# Altium project ATU.PrjPcb
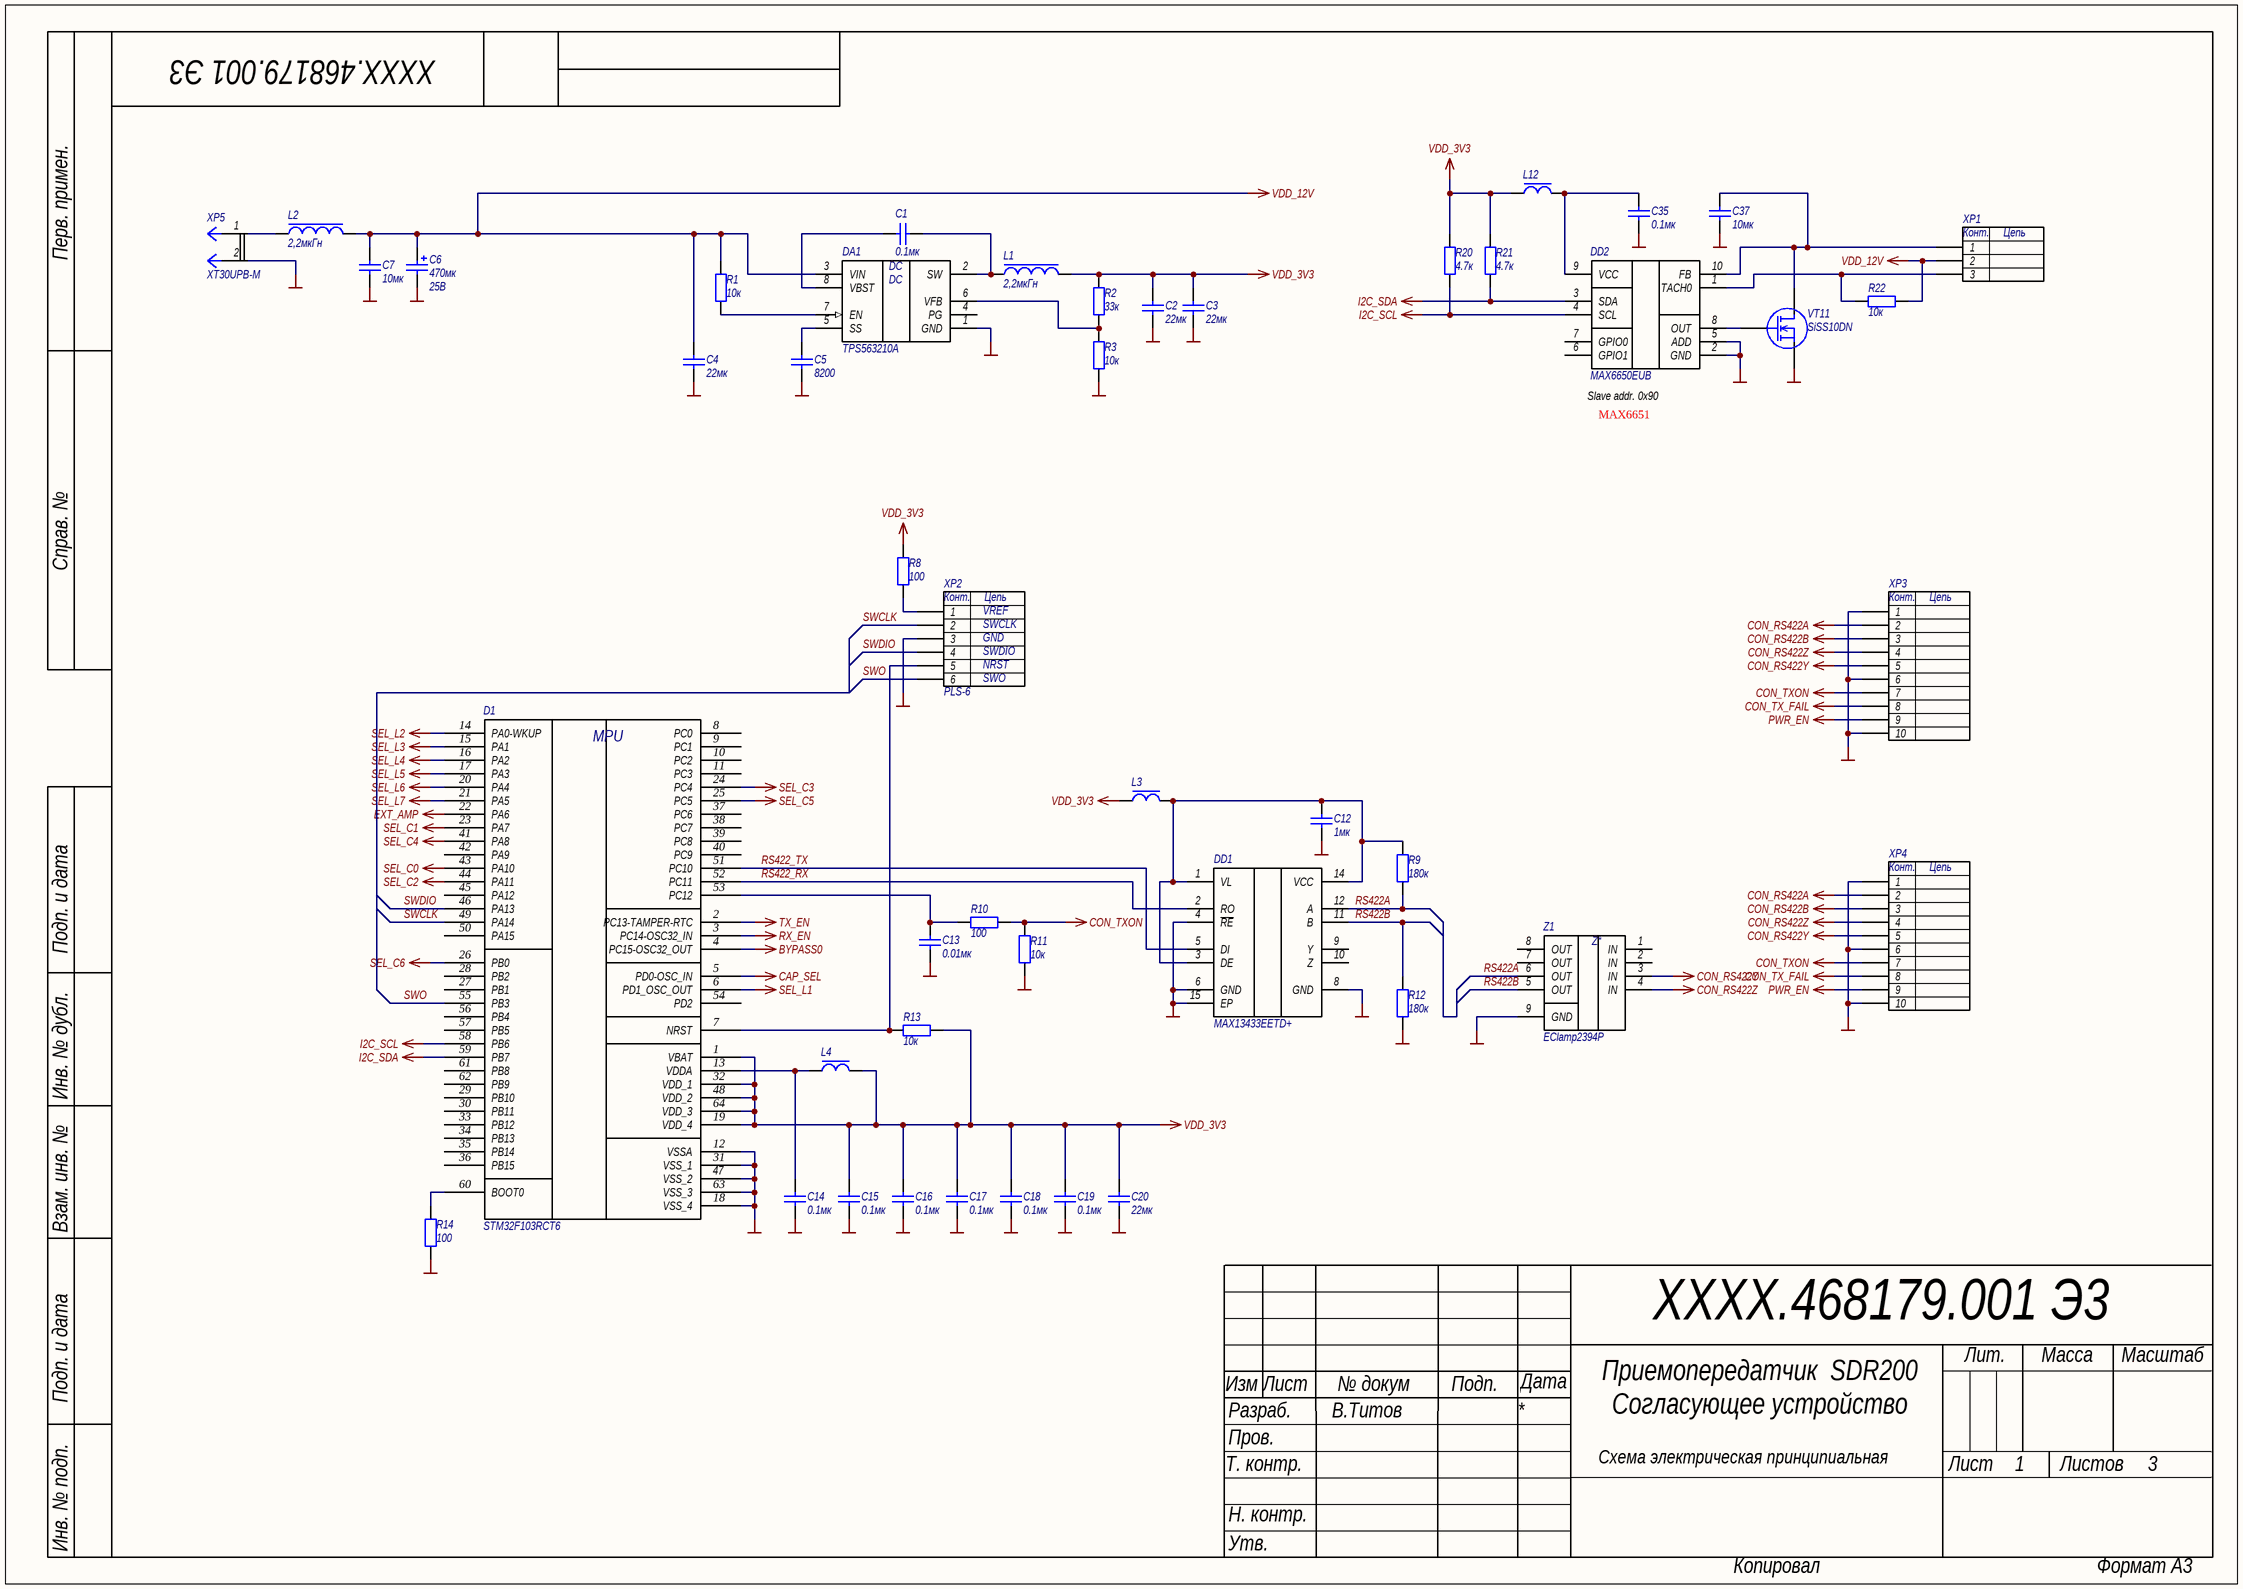
[diagram p0: ATU_MCU.SchDoc]
3 sheets, 161 parts. Net scope: global (net labels, ports and power ports of the same name join across sheets).
Board file: ATU.PcbDoc
Sheets:
  ATU_MCU.SchDoc
  ATU_RF.SchDoc
  ATU_LC.SchDoc

## Sheet ATU_MCU.SchDoc: Приемопередатчик  SDR200
size 420 x 297 mm; Author: В.Титов; DrawnBy: В.Титов; DocumentNumber: ХХХХ.468179.001 Э3; SheetNumber: 1; SheetTotal: 3; DocumentType: Схема электрическая принципиальная; Title2: Согласующее устройство; Scale: 1:1

### Parts
C1  0.1мк  [CAPC1005X06N]
C2  22мк  [CAPC2012X12L]
C3  22мк  [CAPC2012X12L]
C4  22мк  [CAPC2012X12L]
C5  8200  [CAPC1005X06N]
C6  Power/Voltage: 25В  [CAPAE116103X105N]  (hidden comment: 470мк)
C7  10мк  [CAPC3225X27L]
C12  1мк  [CAPC1005X06N]
C13  0.01мк  [CAPC1005X06N]
C14  0.1мк  [CAPC1005X06N]
C15  0.1мк  [CAPC1005X06N]
C16  0.1мк  [CAPC1005X06N]
C17  0.1мк  [CAPC1005X06N]
C18  0.1мк  [CAPC1005X06N]
C19  0.1мк  [CAPC1005X06N]
C20  22мк  [CAPC2012X12L]
C35  0.1мк  [CAPC1005X06N]
C37  10мк  [CAPC3225X27L]
D1  STM32F103RCT6  [QFP50P1200X1200X160-64N]
DA1  TPS563210A  [TSOP65P280X110-8N]
DD1  MAX13433EETD+  [SON40P300X80_HS-15L]
DD2  MAX6650EUB  [SOP64P600X175-16N]
L1  2,2мкГн  [CSAB0420]
L2  2,2мкГн  [CSAB0420]
L3  BLM18PG121SN1D  [INDC1608X08L]  (value not drawn)
L4  BLM18PG121SN1D  [INDC1608X08L]  (value not drawn)
L12  BLM18PG121SN1D  [INDC1608X08L]  (value not drawn)
R1  10к  [RESC1005X06N]
R2  33к  [RESC1005X06N]
R3  10к  [RESC1005X06N]
R8  100  [RESC1005X06N]
R9  180к  [RESC1005X06N]
R10  100  [RESC1005X06N]
R11  10к  [RESC1005X06N]
R12  180к  [RESC1005X06N]
R13  10к  [RESC1005X06N]
R14  100  [RESC1005X06N]
R20  4.7к  [RESC1005X06N]
R21  4.7к  [RESC1005X06N]
R22  10к  [RESC1005X06N]
VT11  SiSS10DN  [PowerPAK_1212-8W]
XP1  22232031  [22232031]  (value not drawn)
XP2  PLS-6  [HDR1X6]
XP3  FH12-10S-0.5SVA  [FH12-10S-0.5SH]  (value not drawn)
XP4  FH12-10S-0.5SVA  [FH12-10S-0.5SH]  (value not drawn)
XP5  XT30UPB-M  [XT30UPB-M]
Z1  EClamp2394P  [SON50P160X65_HS-9N]

### Nets
BYPASS0: D1.4(PC15-OSC32_OUT)
CAP_SEL: D1.5(PD0-OSC_IN)
CON_RS422A: XP3.2 XP4.2
CON_RS422B: XP3.3 XP4.3
CON_RS422Y: XP3.5 XP4.5 Z1.3(IN)
CON_RS422Z: XP3.4 XP4.4 Z1.4(IN)
CON_TX_FAIL: XP3.8 XP4.8
CON_TXON: R10.1 R11.1 XP3.7 XP4.7
EXT_AMP: D1.22(PA6)
GND: C2.1 C3.1 C4.1 C5.1 C6.2 C7.1 C12.1 C13.1 C14.1 C15.1 C16.1 C17.1 C18.1 C19.1 C20.1 C35.1 C37.1 D1.12(VSSA) D1.18(VSS_4) D1.31(VSS_1) D1.47(VSS_2) D1.63(VSS_3) DA1.1(GND) DD1.4(~{RE}) DD1.6(GND) DD1.8(GND) DD1.15(EP) DD2.2(GND) DD2.5(ADD) R3.2 R11.2 R12.1 R14.2 VT11.S XP2.3 XP3.1 XP3.6 XP3.10 XP4.1 XP4.6 XP4.10 XP5.2 Z1.9(GND)
I2C_SCL: D1.58(PB6) DD2.4(SCL) R20.1
I2C_SDA: D1.59(PB7) DD2.3(SDA) R21.1
PWR_EN: XP3.9 XP4.9
RX_EN: D1.3(PC14-OSC32_IN)
SEL_C0: D1.43(PA10)
SEL_C1: D1.23(PA7)
SEL_C2: D1.44(PA11)
SEL_C3: D1.24(PC4)
SEL_C4: D1.41(PA8)
SEL_C5: D1.25(PC5)
SEL_C6: D1.26(PB0)
SEL_L1: D1.6(PD1_OSC_OUT)
SEL_L2: D1.14(PA0-WKUP)
SEL_L3: D1.15(PA1)
SEL_L4: D1.16(PA2)
SEL_L5: D1.17(PA3)
SEL_L6: D1.20(PA4)
SEL_L7: D1.21(PA5)
TX_EN: D1.2(PC13-TAMPER-RTC)
VDD_3V3: C2.2 C3.2 C15.2 C16.2 C17.2 C18.2 C19.2 C20.2 D1.1(VBAT) D1.19(VDD_4) D1.32(VDD_1) D1.48(VDD_2) D1.64(VDD_3) L1.2 L3.1 L4.2 L12.1 R2.2 R8.1 R13.2 R20.2 R21.2
VDD_12V: C4.2 C6.1 C7.2 DA1.3(VIN) L2.2 R1.2 R22.2 XP1.2
RS422_RX: D1.52(PC11) DD1.2(RO)
RS422_TX: D1.51(PC10) DD1.5(DI)
RS422A: DD1.12(A) R9.1 Z1.6(OUT)
RS422B: DD1.11(B) R12.2 Z1.5(OUT)
SWCLK: D1.49(PA14) XP2.2
SWDIO: D1.46(PA13) XP2.4
SWO: D1.55(PB3) XP2.6
NetC1_1: C1.1 DA1.2(SW) L1.1
NetC1_2: C1.2 DA1.8(VBST)
NetC5_2: C5.2 DA1.5(SS)
NetC12_2: C12.2 DD1.1(VL) DD1.3(DE) DD1.14(VCC) L3.2 R9.2
NetC13_2: C13.2 D1.53(PC12) R10.2
NetC14_2: C14.2 D1.13(VDDA) L4.1
NetC35_2: C35.2 DD2.9(VCC) L12.2
NetC37_2: C37.2 DD2.10(FB) VT11.D XP1.1
NetD1_7: D1.7(NRST) R13.1 XP2.5
NetD1_60: D1.60(BOOT0) R14.1
NetDA1_6: DA1.6(VFB) R2.1 R3.1
NetDA1_7: DA1.7(EN) R1.1
NetDD2_1: DD2.1(TACH0) R22.1 XP1.3
NetDD2_8: DD2.8(OUT) VT11.G
NetL2_1: L2.1 XP5.1
NetR8_2: R8.2 XP2.1

Not connected (* = marked no-connect by the designer): D1 8(PC0) 9(PC1) 10(PC2) 11(PC3) 27(PB1) 28(PB2) 29(PB10) 30(PB11) 33(PB12) 34(PB13) 35(PB14) 36(PB15) 37(PC6) 38(PC7) 39(PC8) 40(PC9) 42(PA9) 45(PA12) 50(PA15) 54(PD2) 56(PB4) 57(PB5) 61(PB8) 62(PB9); DA1 4(PG); DD1 9(Y) 10(Z); DD2 6(GPIO1) 7(GPIO0); Z1 1(IN) 2(IN) 7(OUT) 8(OUT)

### Notes on the sheet
- (near DD2) Slave addr. 0x90
- MAX6651
- (near XP2) VREF
- (near XP2) SWCLK
- (near XP2) GND
- (near XP2) SWDIO
- (near XP2) NRST
- (near XP2) SWO
- Перв. примен.
- Справ. №
- Подп. и дата
- Инв. № дубл.
- Взам. инв. №
- Изм
- Лист
- № докум
- Подп.
- Дата
- Лит.
- Масса
- Масштаб
- Т. контр.
- Разраб.
- Пров.
- Листов
- Н. контр.
- Инв. № подп.
- Утв.
- Копировал
- Формат А3
- (in symbol Микросхема STM32F103RCT6) MPU
- (in symbol Микросхема TPS563210A) DC
- (in symbol Соединитель 22232031) Конт.; Цепь
- (in symbol Соединитель FH12-10S-0.5SVA) Конт.; Цепь
- (in symbol Соединитель PLS-6) Конт.; Цепь
- (in symbol Фильтр EMI EClamp2394P) Z*

### Library data of the parts
C1 C14-C19 C35 = Кер.ЧИП конд. 0402 0.1мкФ X7R 10%, 16В: Кер. ЧИП-конденсатор; Power/Voltage: 16В; TKE: X7R; Tolerance: ±10%; PackageReference: 0402; Value: 0.1мк
C2-C4 C20 = Кер.ЧИП конд. 0805 22мкФ X5R 10% 16В: Кер. ЧИП-конденсатор; Manufacturer: TDK; ManufacturerPartNumber: C2012X5R1C226KT; Power/Voltage: 16В; TKE: X5R; Tolerance: ±10%; Value: 22мк
C5 = Кер.ЧИП конд. 0402 8200пФ X7R 10%, 50В: Кер. ЧИП-конденсатор; Power/Voltage: 50В; TKE: X7R; Tolerance: ±20%; Value: 8200
C6 = Конденсатор гибридный SMD 470мкФ ±20% 25В: Гибридный ЧИП-конденсатор; ManufacturerPartNumber: EEHZK1E471P; Manufacturer: Panasonic; Tolerance: ±20%; Published: 8-Jun-2000; LatestRevisionDate: 29-May-2009; LatestRevisionNote: IPC-7351 Footprint Added.; Publisher: Altium Limited; PackageDescription: ZK series; PackageReference: ZK series; Value: 470мк
C7 C37 = Кер.ЧИП конд. 1210 10мкФ X5R 20% 50В: Кер. ЧИП-конденсатор; Manufacturer: Murata; ManufacturerPartNumber: GRM32ER71H106; Power/Voltage: 50В; TKE: X5R; Tolerance: ±20%; Value: 10мк
C12 = Кер.ЧИП конд. 0402 1мкФ X5R 10%, 10В: Кер. ЧИП-конденсатор; Power/Voltage: 10В; TKE: X5R; Tolerance: ±10%; PackageReference: 0402; Value: 1мк
C13 = Кер.ЧИП конд. 0402 0.01мкФ X7R 10%, 50В: Кер. ЧИП-конденсатор; Power/Voltage: 50В; TKE: X7R; Tolerance: ±20%; Value: 0.01мк
D1 = Микросхема STM32F103RCT6: Ultra-low-power 32-bit MCU ARM®-based Cortex®-M3, 128KB Flash, 16KB SRAM, 4KB EEPROM, LCD, USB, ADC, DAC; Manufacturer: STMicroelectronics; Published: 29-Jan-2009; Code_JEDEC: MS-026; ComponentLink1Description: Manufacturer Link; ComponentLink3Description: Packaging Specification; Value: STM32F103RCT6
DA1 = Микросхема TPS563210A: TPS56x210A, 4.5-V to 17-V Input, 2-A, 3-A Synchrono; Manufacturer: TI; Value: TPS563210A
DD1 = Микросхема MAX13433EETD+: RS-422 Transceivers with Low-Voltage Logic Interface 16M; Manufacturer: Maxim; Value: MAX13433EETD+; ComponentLink1Description: datasheet; ComponentLink1URL: https://datasheets.maximintegrated.com/en/ds/MAX13430E-MAX13433E.pdf
DD2 = Микросхема MAX6650EUB: Fan-Speed Regulators and Monitors with SMBus/I2C-Compatible Interface; Manufacturer: Maxim; Value: MAX6650EUB; ComponentLink1Description: datasheet; ComponentLink1URL: https://www.analog.com/media/en/technical-documentation/data-sheets/MAX6650-MAX6651.pdf
L1 L2 = ЧИП индуктивность CSAB0420-2R2M: Molding Power Choke; Manufacturer: Vishay; ManufacturerPartNumber: IHLP1616ABER1R0M11; Value: 2,2мкГн
L3 L4 L12 = ЧИП дроссель 0603 BLM18PG121SN1D: SMD EMI Suppression Filter EMIFIL; Manufacturer: Murata; ManufacturerPartNumber: BLM18PG121SN1D; Value: BLM18PG121SN1D
R1 = Чип резистор 0402 10 кОм, 1%: ЧИП-резистор; Tolerance: ±5%; TKE: 100 ppm/°С; PackageReference: 0402; Value: 10к
R2 = Чип резистор 0402 33 кОм, 5%: ЧИП-резистор; Tolerance: ±5%; TKE: 100 ppm/°С; PackageReference: 0402; Value: 33к
R3 R11 R13 R22 = Чип резистор 0402 10 кОм, 5%: ЧИП-резистор; Tolerance: ±5%; TKE: 100 ppm/°С; PackageReference: 0402; Value: 10к
R8 R10 R14 = Чип резистор 0402 100 Ом, 5%: ЧИП-резистор; Tolerance: ±5%; TKE: 100 ppm/°С; PackageReference: 0402; Value: 100
R9 R12 = Чип резистор 0402 180 кОм, 5%: ЧИП-резистор; Tolerance: ±5%; TKE: 100 ppm/°С; PackageReference: 0402; Value: 180к
R20 R21 = Чип резистор 0402 4,7 кОм, 5%: ЧИП-резистор; Tolerance: ±5%; TKE: 100 ppm/°С; PackageReference: 0402; Value: 4.7к
VT11 = ЧИП транзистор SiSS10DN: N-Channel 40 V (D-S) MOSFET; ComponentLink1Description: datasheet; ComponentLink1URL: https://www.vishay.com/docs/65439/siss10dn.pdf; Value: SiSS10DN
XP1 = Соединитель 22232031: Molex 2,54 мм pitch-3; Manufacturer: Connfly; Value: 22232031
XP2 = Соединитель PLS-6: Вилка штыревая 2.54мм 1x6 прямая тип1; LatestRevisionDate: 17-Jul-2002; LatestRevisionNote: Re-released for DXP Platform.; Publisher: Altium Limited; Value: PLS-6
XP3 XP4 = Соединитель FH12-10S-0.5SVA: 0.5mm  Pitch FPC/FFC Connector FH12 Series; Manufacturer: Hirose; Value: FH12-10S-0.5SVA
XP5 = Соединитель XT30UPB-M: AMASS XT30UPB-M  5 mm; Value: XT30UPB-M
Z1 = Фильтр EMI EClamp2394P: ESD/EMI Protection  for Color LCD Interfaces; Manufacturer: SEMTECH; PackageReference: SLP2116P8; Value: EClamp2394P

## Sheet ATU_RF.SchDoc: Приемопередатчик  SDR200
size 420 x 297 mm; Author: В.Титов; DrawnBy: В.Титов; DocumentNumber: ХХХХ.468179.001 Э3; SheetNumber: 2; SheetTotal: 3; DocumentType: Схема электрическая принципиальная; Title2: Согласующее устройство; Scale: 1:1
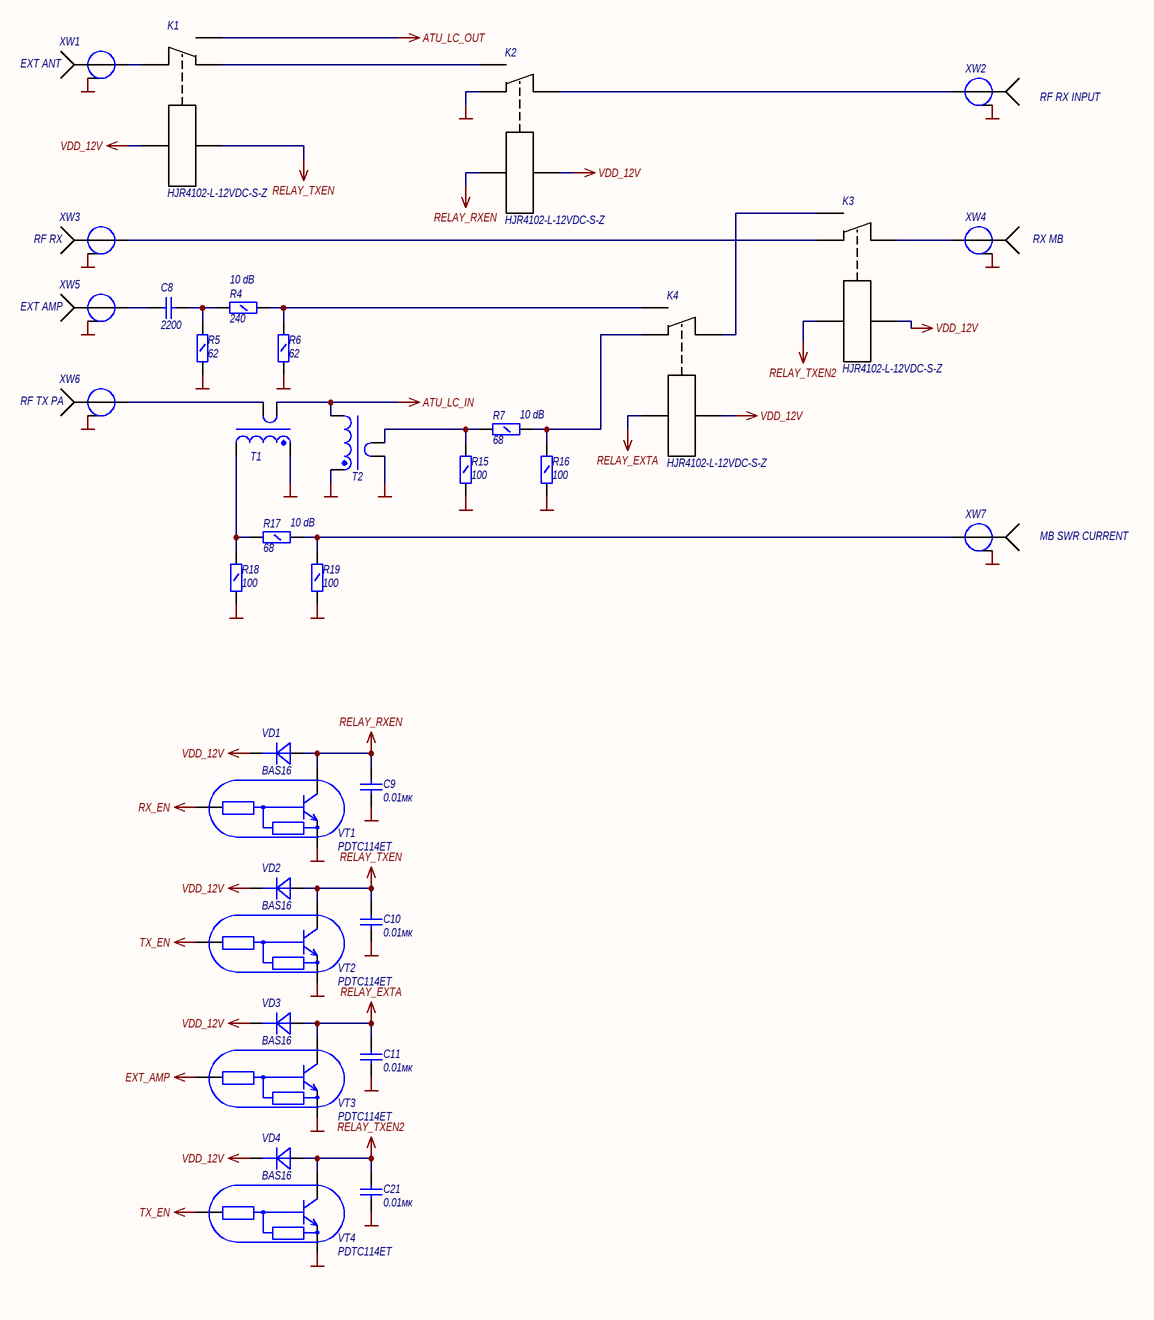
[diagram p1: ATU_RF.SchDoc]

### Parts
C8  2200  [CAPC3216X19L]
C9  0.01мк  [CAPC1005X06N]
C10  0.01мк  [CAPC1005X06N]
C11  0.01мк  [CAPC1005X06N]
C21  0.01мк  [CAPC1005X06N]
K1  HJR4102-L-12VDC-S-Z  [HJR4102]
K2  HJR4102-L-12VDC-S-Z  [HJR4102]
K3  HJR4102-L-12VDC-S-Z  [HJR4102]
K4  HJR4102-L-12VDC-S-Z  [HJR4102]
R4  240  [RESC3216X04L]
R5  62  [RESC3216X04L]
R6  62  [RESC3216X04L]
R7  68  [RESC3216X04L]
R15  100  [RESC3216X04L]
R16  100  [RESC3216X04L]
R17  68  [RESC3216X04L]
R18  100  [RESC3216X04L]
R19  100  [RESC3216X04L]
T1  Трансформатор SWR_CURRENT  [TRSF PA CURRENT]  (value not drawn)
T2  Трансформатор SWR_VOLTAGE  [TRSF PA VOLTAGE]  (value not drawn)
VD1  BAS16  [SOT23_N]
VD2  BAS16  [SOT23_N]
VD3  BAS16  [SOT23_N]
VD4  BAS16  [SOT23_N]
VT1  PDTC114ET  [SOT23_N]
VT2  PDTC114ET  [SOT23_N]
VT3  PDTC114ET  [SOT23_N]
VT4  PDTC114ET  [SOT23_N]
XW1  SMA-JR  [SMA-JR]  (value not drawn)
XW2  SMA-JR  [SMA-JR]  (value not drawn)
XW3  SMA-JR  [SMA-JR]  (value not drawn)
XW4  SMA-JR  [SMA-JR]  (value not drawn)
XW5  SMA-JR  [SMA-JR]  (value not drawn)
XW6  SMA-JR  [SMA-JR]  (value not drawn)
XW7  SMA-JR  [SMA-JR]  (value not drawn)

### Nets
ATU_LC_IN: T1.1 T2.4
ATU_LC_OUT: K1.6
EXT_AMP: VT3.1(B)
GND: C9.1 C10.1 C11.1 C21.1 K2.7 R5.1 R6.1 R15.1 R16.1 R18.1 R19.1 T1.3 T2.1 T2.3 VT1.2(E) VT2.2(E) VT3.2(E) VT4.2(E) XW1.2 XW2.2 XW3.2 XW4.2 XW5.2 XW6.2 XW7.2
RELAY_EXTA: C11.2 K4.5 VD3.1(A) VT3.3(C)
RELAY_RXEN: C9.2 K2.5 VD1.1(A) VT1.3(C)
RELAY_TXEN: C10.2 K1.5 VD2.1(A) VT2.3(C)
RELAY_TXEN2: C21.2 K3.5 VD4.1(A) VT4.3(C)
RX_EN: VT1.1(B)
TX_EN: VT2.1(B) VT4.1(B)
VDD_12V: K1.8 K2.8 K3.8 K4.8 VD1.3(K) VD2.3(K) VD3.3(K) VD4.3(K)
NetC8_1: C8.1 R4.1 R5.2
NetC8_2: C8.2 XW5.1
NetK1_1: K1.1 XW1.1
NetK1_7: K1.7 K2.6
NetK2_1: K2.1 XW2.1
NetK3_1: K3.1 XW4.1
NetK3_6: K3.6 K4.1
NetK3_7: K3.7 XW3.1
NetK4_6: K4.6 R4.2 R6.2
NetK4_7: K4.7 R7.2 R16.2
NetR7_1: R7.1 R15.2 T2.2
NetR17_1: R17.1 R18.2 T1.4
NetR17_2: R17.2 R19.2 XW7.1
NetT1_2: T1.2 XW6.1

### Notes on the sheet
- (near XW1) EXT ANT
- RF RX INPUT
- (near XW3) RF RX
- (near R4) 10 dB
- RX MB
- EXT AMP
- (near XW6) RF TX PA
- (near R7) 10 dB
- (near R17) 10 dB
- MB SWR CURRENT
- Перв. примен.
- Справ. №
- Подп. и дата
- Инв. № дубл.
- Взам. инв. №
- Изм
- Лист
- № докум
- Подп.
- Дата
- Лит.
- Масса
- Масштаб
- Т. контр.
- Разраб.
- Пров.
- Листов
- Н. контр.
- Инв. № подп.
- Утв.
- Копировал
- Формат А3

### Library data of the parts
C8 = Кер.ЧИП конд. 1206 2200пФ X7К 10% 1000В: Кер. ЧИП-конденсатор; Manufacturer: WALSIN; ManufacturerPartNumber: 1206B222K102; Power/Voltage: 1000В; TKE: X7R; Tolerance: ±10%; Value: 2200
C9-C11 C21 = Кер.ЧИП конд. 0402 0.01мкФ X7R 10%, 50В: as C13 on sheet ATU_MCU; Value: 0.01мк
K1-K4 = Реле HJR4102-L-12VDC-S-Z: Реле 1пер. 12VDC, 1A/240VAC; Value: HJR4102-L-12VDC-S-Z; ComponentLink1Description: datasheet; ComponentLink1URL: https://www.ti.com/lit/ds/symlink/tlvh431a.pdf?ts=1606914625003&ref_url=https%253A%252F%252Fwww.google.com%252F
R4 = Чип резистор 1206 240 Ом, 5%: ЧИП-резистор; Manufacturer: ROHM; Tolerance: ±5%; TKE: 300 ppm/°С; PackageReference: 1206; Value: 240
R5 R6 = Чип резистор 1206 62 Ом, 5%: ЧИП-резистор; Manufacturer: ROHM; Tolerance: ±5%; TKE: 300 ppm/°С; PackageReference: 1206; Value: 62
R7 R17 = Чип резистор 1206 68 Ом, 5%: ЧИП-резистор; Manufacturer: ROHM; Tolerance: ±5%; TKE: 300 ppm/°С; PackageReference: 1206; Value: 68
R15 R16 R18 R19 = Чип резистор 1206 100 Ом, 5%: ЧИП-резистор; Manufacturer: ROHM; Tolerance: ±5%; TKE: 300 ppm/°С; PackageReference: 1206; Value: 100
VD1-VD4 = ЧИП диод BAS16: High-speed switching diodes; Manufacturer: Nexperia; Power/Voltage: 100В; ManufacturerPartNumber: BAS16; Value: BAS16; ComponentLink1Description: datasheet; ComponentLink1URL: https://assets.nexperia.com/documents/data-sheet/BAS16_SER.pdf
VT1-VT4 = ЧИП транзистор PDTC114ET: NPN resistor-equipped transistors;  R1 = 10 k, R2 = 10; ComponentLink1Description: datasheet; ComponentLink1URL: https://assets.nexperia.com/documents/data-sheet/PDTC114E_SER.pdf; Value: PDTC114ET
XW1-XW7 = Соединитель коаксиальный SMA-JR: SMA-JR Разъем SMA гнездо на плату, прямой угол; Value: SMA-JR; ComponentLink1Description: datasheet; ComponentLink1URL: http://www.brownbear.ru/goods/2243.html

## Sheet ATU_LC.SchDoc: Приемопередатчик  SDR200
size 420 x 297 mm; Author: В.Титов; DrawnBy: В.Титов; DocumentNumber: ХХХХ.468179.001 Э3; SheetNumber: 3; SheetTotal: 3; DocumentType: Схема электрическая принципиальная; Title2: Согласующее устройство; Scale: 1:1
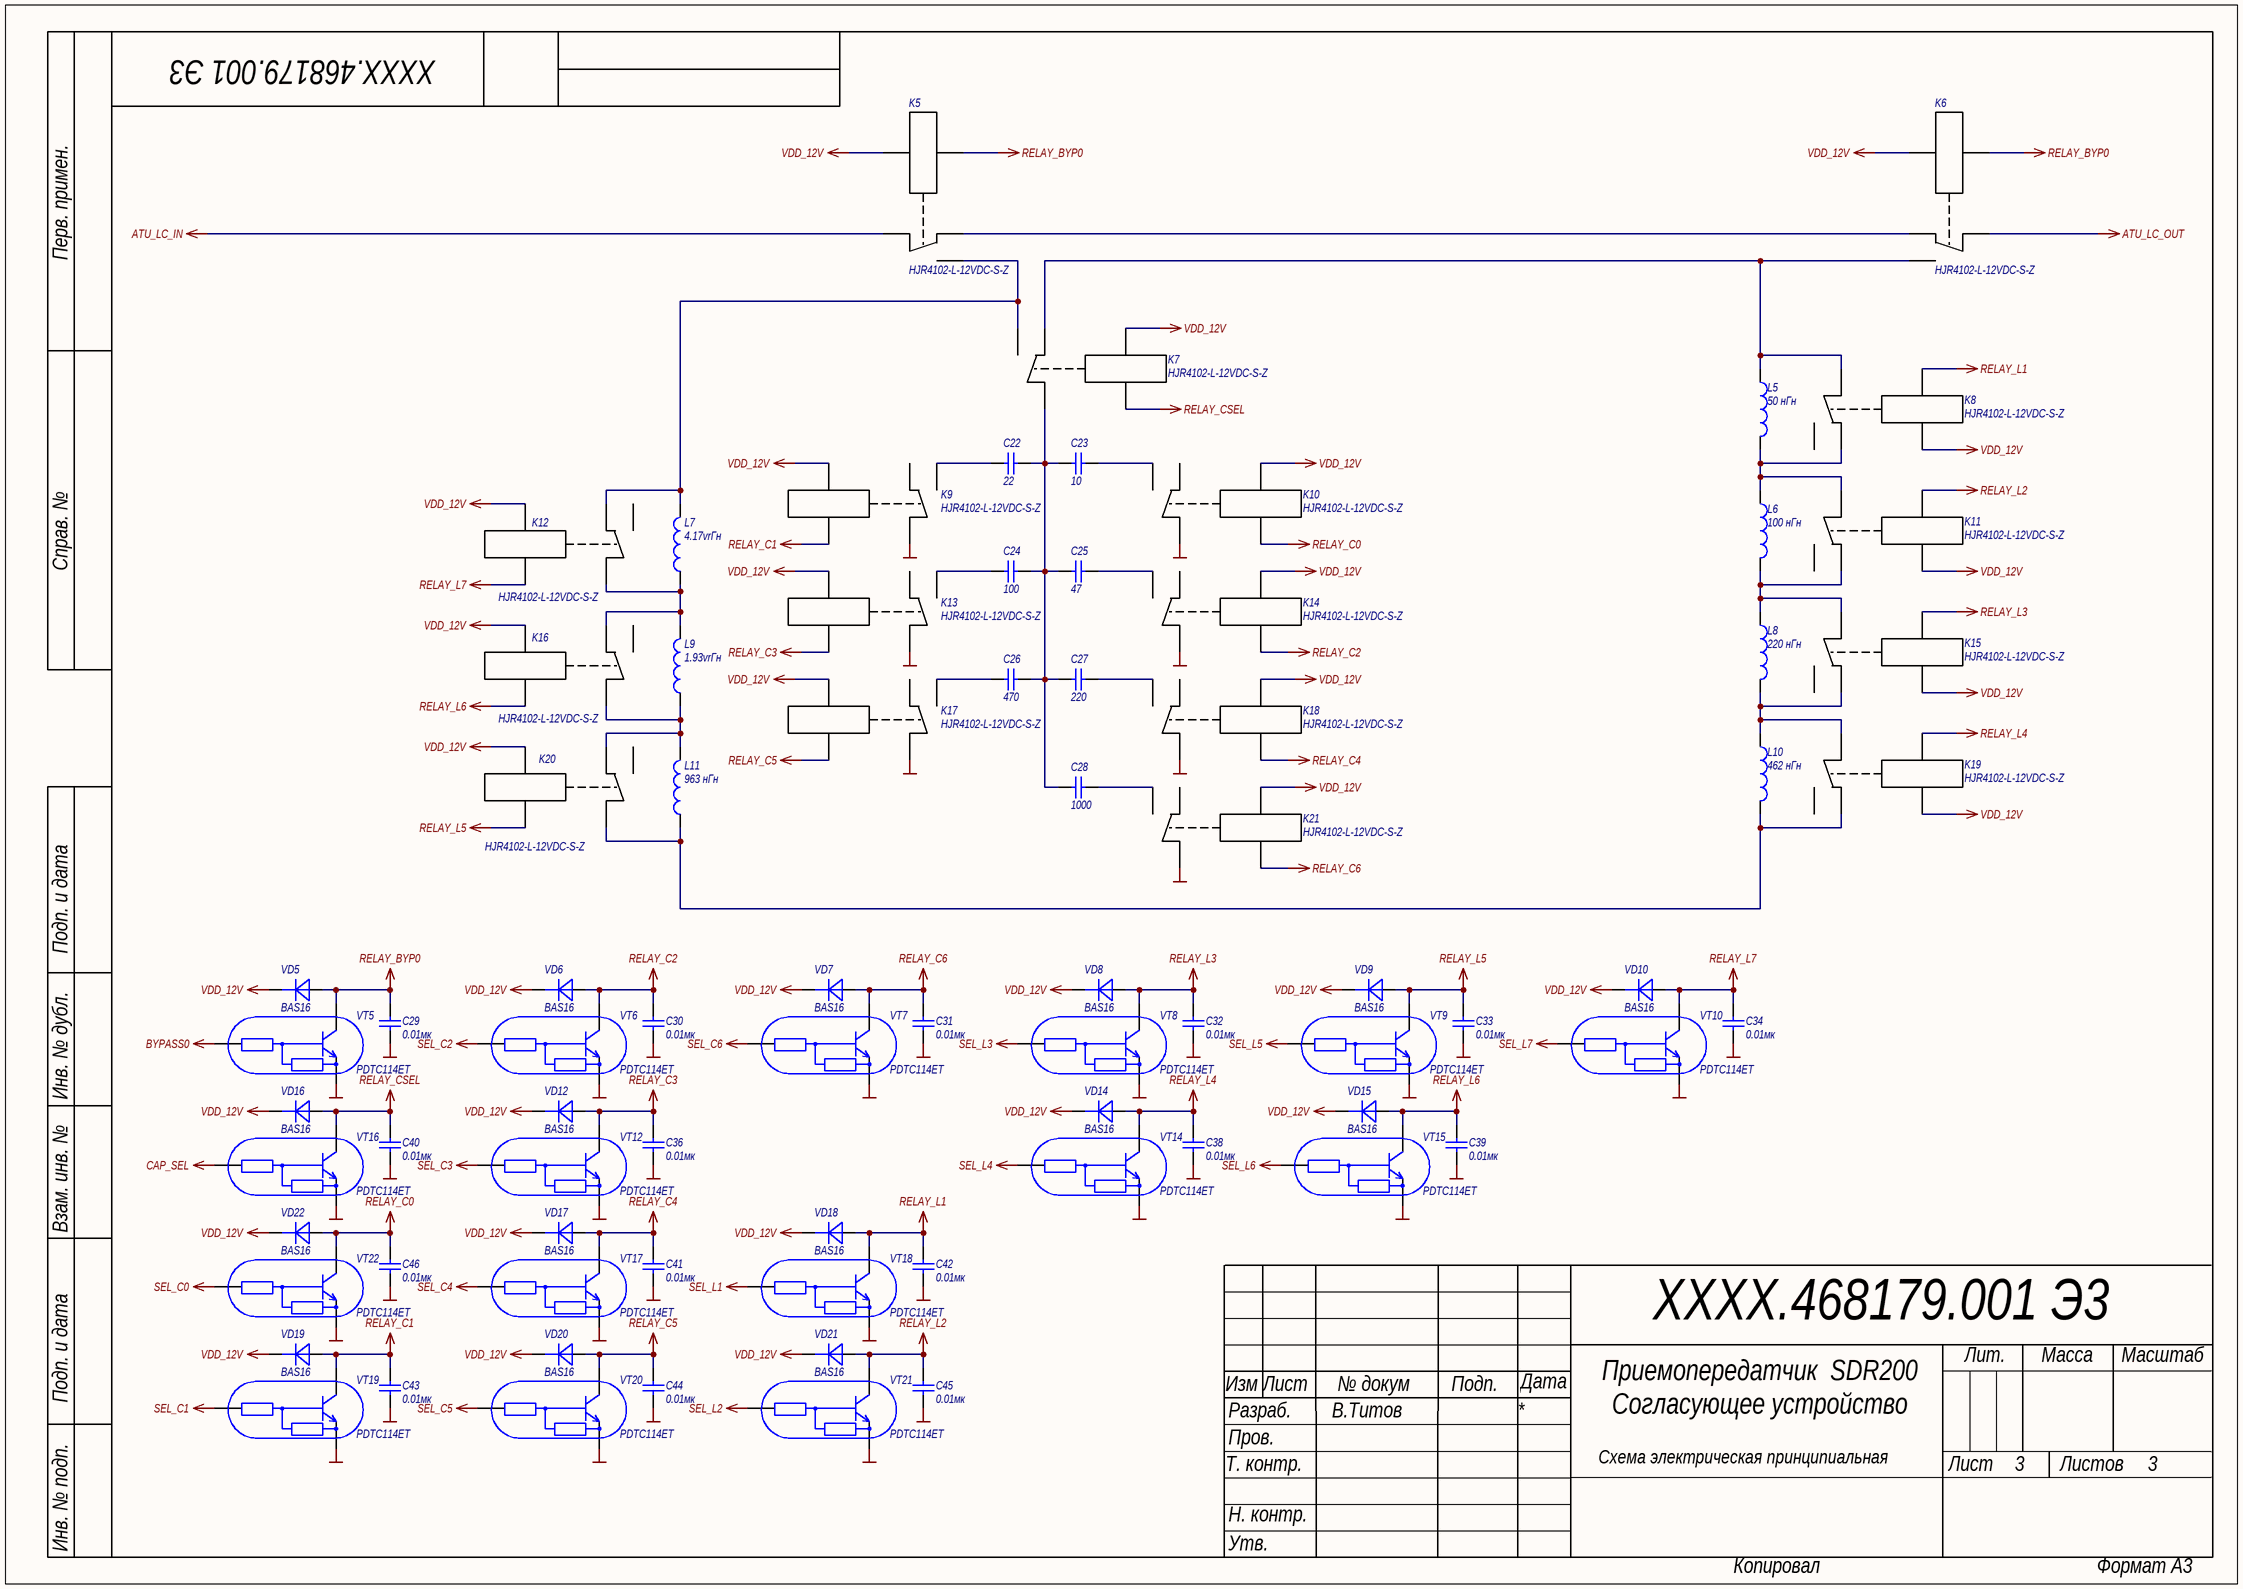
[diagram p2: ATU_LC.SchDoc]

### Parts
C22  22  [CAPC3216X19L]
C23  10  [CAPC3216X19L]
C24  100  [CAPC3216X19L]
C25  47  [CAPC3216X19L]
C26  470  [CAPC3216X19L]
C27  220  [CAPC3216X19L]
C28  1000  [CAPC3216X19L]
C29  0.01мк  [CAPC1005X06N]
C30  0.01мк  [CAPC1005X06N]
C31  0.01мк  [CAPC1005X06N]
C32  0.01мк  [CAPC1005X06N]
C33  0.01мк  [CAPC1005X06N]
C34  0.01мк  [CAPC1005X06N]
C36  0.01мк  [CAPC1005X06N]
C38  0.01мк  [CAPC1005X06N]
C39  0.01мк  [CAPC1005X06N]
C40  0.01мк  [CAPC1005X06N]
C41  0.01мк  [CAPC1005X06N]
C42  0.01мк  [CAPC1005X06N]
C43  0.01мк  [CAPC1005X06N]
C44  0.01мк  [CAPC1005X06N]
C45  0.01мк  [CAPC1005X06N]
C46  0.01мк  [CAPC1005X06N]
K5  HJR4102-L-12VDC-S-Z  [HJR4102]
K6  HJR4102-L-12VDC-S-Z  [HJR4102]
K7  HJR4102-L-12VDC-S-Z  [HJR4102]
K8  HJR4102-L-12VDC-S-Z  [HJR4102]
K9  HJR4102-L-12VDC-S-Z  [HJR4102]
K10  HJR4102-L-12VDC-S-Z  [HJR4102]
K11  HJR4102-L-12VDC-S-Z  [HJR4102]
K12  HJR4102-L-12VDC-S-Z  [HJR4102]
K13  HJR4102-L-12VDC-S-Z  [HJR4102]
K14  HJR4102-L-12VDC-S-Z  [HJR4102]
K15  HJR4102-L-12VDC-S-Z  [HJR4102]
K16  HJR4102-L-12VDC-S-Z  [HJR4102]
K17  HJR4102-L-12VDC-S-Z  [HJR4102]
K18  HJR4102-L-12VDC-S-Z  [HJR4102]
K19  HJR4102-L-12VDC-S-Z  [HJR4102]
K20  HJR4102-L-12VDC-S-Z  [HJR4102]
K21  HJR4102-L-12VDC-S-Z  [HJR4102]
L5  50 нГн  [COIL D4 W3 L3]
L6  100 нГн  [COIL D6.4 W4 L3.5]
L7  4.17vrГн  [T68-2x2]
L8  220 нГн  [COIL D6.4 W7 L6]
L9  1.93vrГн  [T68-2x2]
L10  462 нГн  [T68-2]
L11  963 нГн  [T68-2]
VD5  BAS16  [SOT23_N]
VD6  BAS16  [SOT23_N]
VD7  BAS16  [SOT23_N]
VD8  BAS16  [SOT23_N]
VD9  BAS16  [SOT23_N]
VD10  BAS16  [SOT23_N]
VD12  BAS16  [SOT23_N]
VD14  BAS16  [SOT23_N]
VD15  BAS16  [SOT23_N]
VD16  BAS16  [SOT23_N]
VD17  BAS16  [SOT23_N]
VD18  BAS16  [SOT23_N]
VD19  BAS16  [SOT23_N]
VD20  BAS16  [SOT23_N]
VD21  BAS16  [SOT23_N]
VD22  BAS16  [SOT23_N]
VT5  PDTC114ET  [SOT23_N]
VT6  PDTC114ET  [SOT23_N]
VT7  PDTC114ET  [SOT23_N]
VT8  PDTC114ET  [SOT23_N]
VT9  PDTC114ET  [SOT23_N]
VT10  PDTC114ET  [SOT23_N]
VT12  PDTC114ET  [SOT23_N]
VT14  PDTC114ET  [SOT23_N]
VT15  PDTC114ET  [SOT23_N]
VT16  PDTC114ET  [SOT23_N]
VT17  PDTC114ET  [SOT23_N]
VT18  PDTC114ET  [SOT23_N]
VT19  PDTC114ET  [SOT23_N]
VT20  PDTC114ET  [SOT23_N]
VT21  PDTC114ET  [SOT23_N]
VT22  PDTC114ET  [SOT23_N]

### Nets
ATU_LC_IN: K5.1
ATU_LC_OUT: K6.1
BYPASS0: VT5.1(B)
CAP_SEL: VT16.1(B)
GND: C29.1 C30.1 C31.1 C32.1 C33.1 C34.1 C36.1 C38.1 C39.1 C40.1 C41.1 C42.1 C43.1 C44.1 C45.1 C46.1 K9.1 K10.1 K13.1 K14.1 K17.1 K18.1 K21.1 VT5.2(E) VT6.2(E) VT7.2(E) VT8.2(E) VT9.2(E) VT10.2(E) VT12.2(E) VT14.2(E) VT15.2(E) VT16.2(E) VT17.2(E) VT18.2(E) VT19.2(E) VT20.2(E) VT21.2(E) VT22.2(E)
RELAY_BYP0: C29.2 K5.5 K6.8 VD5.1(A) VT5.3(C)
RELAY_C0: C46.2 K10.8 VD22.1(A) VT22.3(C)
RELAY_C1: C43.2 K9.8 VD19.1(A) VT19.3(C)
RELAY_C2: C30.2 K14.8 VD6.1(A) VT6.3(C)
RELAY_C3: C36.2 K13.8 VD12.1(A) VT12.3(C)
RELAY_C4: C41.2 K18.8 VD17.1(A) VT17.3(C)
RELAY_C5: C44.2 K17.8 VD20.1(A) VT20.3(C)
RELAY_C6: C31.2 K21.8 VD7.1(A) VT7.3(C)
RELAY_CSEL: C40.2 K7.8 VD16.1(A) VT16.3(C)
RELAY_L1: C42.2 K8.8 VD18.1(A) VT18.3(C)
RELAY_L2: C45.2 K11.8 VD21.1(A) VT21.3(C)
RELAY_L3: C32.2 K15.8 VD8.1(A) VT8.3(C)
RELAY_L4: C38.2 K19.8 VD14.1(A) VT14.3(C)
RELAY_L5: C33.2 K20.8 VD9.1(A) VT9.3(C)
RELAY_L6: C39.2 K16.8 VD15.1(A) VT15.3(C)
RELAY_L7: C34.2 K12.8 VD10.1(A) VT10.3(C)
SEL_C0: VT22.1(B)
SEL_C1: VT19.1(B)
SEL_C2: VT6.1(B)
SEL_C3: VT12.1(B)
SEL_C4: VT17.1(B)
SEL_C5: VT20.1(B)
SEL_C6: VT7.1(B)
SEL_L1: VT18.1(B)
SEL_L2: VT21.1(B)
SEL_L3: VT8.1(B)
SEL_L4: VT14.1(B)
SEL_L5: VT9.1(B)
SEL_L6: VT15.1(B)
SEL_L7: VT10.1(B)
VDD_12V: K5.8 K6.5 K7.5 K8.5 K9.5 K10.5 K11.5 K12.5 K13.5 K14.5 K15.5 K16.5 K17.5 K18.5 K19.5 K20.5 K21.5 VD5.3(K) VD6.3(K) VD7.3(K) VD8.3(K) VD9.3(K) VD10.3(K) VD12.3(K) VD14.3(K) VD15.3(K) VD16.3(K) VD17.3(K) VD18.3(K) VD19.3(K) VD20.3(K) VD21.3(K) VD22.3(K)
NetC22_1: C22.1 C23.2 C24.1 C25.2 C26.1 C27.2 C28.2 K7.1
NetC22_2: C22.2 K9.6
NetC23_1: C23.1 K10.6
NetC24_2: C24.2 K13.6
NetC25_1: C25.1 K14.6
NetC26_2: C26.2 K17.6
NetC27_1: C27.1 K18.6
NetC28_1: C28.1 K21.6
NetK5_6: K5.6 K7.6 K12.7 L7.2
NetK5_7: K5.7 K6.7
NetK6_6: K6.6 K7.7 K8.1 L5.1
NetK8_7: K8.7 K11.1 L5.2 L6.1
NetK11_7: K11.7 K15.1 L6.2 L8.1
NetK12_1: K12.1 K16.7 L7.1 L9.2
NetK15_7: K15.7 K19.1 L8.2 L10.1
NetK16_1: K16.1 K20.7 L9.1 L11.2
NetK19_7: K19.7 K20.1 L10.2 L11.1

Not connected (* = marked no-connect by the designer): K8 6; K9 7; K10 7; K11 6; K12 6; K13 7; K14 7; K15 6; K16 6; K17 7; K18 7; K19 6; K20 6; K21 7

### Notes on the sheet
- Перв. примен.
- Справ. №
- Подп. и дата
- Инв. № дубл.
- Взам. инв. №
- Изм
- Лист
- № докум
- Подп.
- Дата
- Лит.
- Масса
- Масштаб
- Т. контр.
- Разраб.
- Пров.
- Листов
- Н. контр.
- Инв. № подп.
- Утв.
- Копировал
- Формат А3

### Library data of the parts
C22 = Кер.ЧИП конд. 1206 22пФ NP0 5% 2000В: Кер. ЧИП-конденсатор; Manufacturer: WALSIN; ManufacturerPartNumber: 1206N220J202; Power/Voltage: 2000В; TKE: NP0; Tolerance: ±5%; Value: 22
C23 = Кер.ЧИП конд. 1206 10пФ NP0 5% 2000В: Кер. ЧИП-конденсатор; Manufacturer: WALSIN; ManufacturerPartNumber: 1206N100J202; Power/Voltage: 2000В; TKE: NP0; Tolerance: ±5%; Value: 10
C24 = Кер.ЧИП конд. 1206 100пФ NP0 5% 2000В: Кер. ЧИП-конденсатор; Manufacturer: WALSIN; ManufacturerPartNumber: 1206N101J202; Power/Voltage: 2000В; TKE: NP0; Tolerance: ±5%; Value: 100
C25 = Кер.ЧИП конд. 1206 47пФ NP0 5% 2000В: Кер. ЧИП-конденсатор; Manufacturer: WALSIN; ManufacturerPartNumber: 1206N470J202; Power/Voltage: 2000В; TKE: NP0; Tolerance: ±5%; Value: 47
C26 = Кер.ЧИП конд. 1206 470пФ NP0 10% 2000В: Кер. ЧИП-конденсатор; Manufacturer: WALSIN; ManufacturerPartNumber: 1206B471K202; Power/Voltage: 2000В; TKE: NP0; Tolerance: ±10%; Value: 470
C27 = Кер.ЧИП конд. 1206 220пФ NP0 5% 2000В: Кер. ЧИП-конденсатор; Manufacturer: Johanson; ManufacturerPartNumber: 202R18W102KV4E; Power/Voltage: 2000В; TKE: X7R; Tolerance: ±10%; Value: 220
C28 = Кер.ЧИП конд. 1206 1000пФ X7К 10% 2000В: Кер. ЧИП-конденсатор; Manufacturer: Johanson; ManufacturerPartNumber: 202R18W102KV4E; Power/Voltage: 2000В; TKE: X7R; Tolerance: ±10%; Value: 1000
C29-C34 C36 C38-C46 = Кер.ЧИП конд. 0402 0.01мкФ X7R 10%, 50В: as C13 on sheet ATU_MCU; Value: 0.01мк
K5-K21 = Реле HJR4102-L-12VDC-S-Z: Реле 1пер. 12VDC, 1A/240VAC; Value: HJR4102-L-12VDC-S-Z; ComponentLink1Description: datasheet; ComponentLink1URL: https://www.ti.com/lit/ds/symlink/tlvh431a.pdf?ts=1606914625003&ref_url=https%253A%252F%252Fwww.google.com%252F
L5 = Индуктивность 50 нГн: 3 витка, диаметр 4мм, длина 3мм, провод 0,5мм; Value: 50 нГн
L6 = Индуктивность  100 нГн: 4 витка, диаметр 6мм, длина 3.5мм, провод 0.8мм; Value: 100 нГн
L7 = Индуктивность 2XT68-2 4.17vrГн: 13 витков на 2 кольцах; Value: 4.17vrГн
L8 = Индуктивность 220 нГн: 7 витков, диаметр 6мм, длина 6мм, провод 0.8мм; Value: 220 нГн
L9 = Индуктивность 2XT68-2 1.93vrГн: 13 витков на 2 кольцах; Value: 1.93vrГн
L10 = Индуктивность T68-2 462 нГн: 9 витков; Value: 462 нГн
L11 = Индуктивность T68-2 963 нГн: 13 витков; Value: 963 нГн
VD5-VD10 VD12 VD14-VD22 = ЧИП диод BAS16: as VD1 on sheet ATU_RF; ManufacturerPartNumber: BAS16; Value: BAS16; ComponentLink1Description: datasheet; ComponentLink1URL: https://assets.nexperia.com/documents/data-sheet/BAS16_SER.pdf
VT5-VT10 VT12 VT14-VT22 = ЧИП транзистор PDTC114ET: as VT1 on sheet ATU_RF; ComponentLink1Description: datasheet; ComponentLink1URL: https://assets.nexperia.com/documents/data-sheet/PDTC114E_SER.pdf; Value: PDTC114ET

## Nets that join several sheets
ATU_LC_IN: ATU_RF (T1.1 T2.4), ATU_LC (K5.1)
ATU_LC_OUT: ATU_RF (K1.6), ATU_LC (K6.1)
BYPASS0: ATU_MCU (D1.4), ATU_LC (VT5.1)
CAP_SEL: ATU_MCU (D1.5), ATU_LC (VT16.1)
EXT_AMP: ATU_MCU (D1.22), ATU_RF (VT3.1)
GND: ATU_MCU (43 pins), ATU_RF (25 pins), ATU_LC (39 pins)
RX_EN: ATU_MCU (D1.3), ATU_RF (VT1.1)
SEL_C0: ATU_MCU (D1.43), ATU_LC (VT22.1)
SEL_C1: ATU_MCU (D1.23), ATU_LC (VT19.1)
SEL_C2: ATU_MCU (D1.44), ATU_LC (VT6.1)
SEL_C3: ATU_MCU (D1.24), ATU_LC (VT12.1)
SEL_C4: ATU_MCU (D1.41), ATU_LC (VT17.1)
SEL_C5: ATU_MCU (D1.25), ATU_LC (VT20.1)
SEL_C6: ATU_MCU (D1.26), ATU_LC (VT7.1)
SEL_L1: ATU_MCU (D1.6), ATU_LC (VT18.1)
SEL_L2: ATU_MCU (D1.14), ATU_LC (VT21.1)
SEL_L3: ATU_MCU (D1.15), ATU_LC (VT8.1)
SEL_L4: ATU_MCU (D1.16), ATU_LC (VT14.1)
SEL_L5: ATU_MCU (D1.17), ATU_LC (VT9.1)
SEL_L6: ATU_MCU (D1.20), ATU_LC (VT15.1)
SEL_L7: ATU_MCU (D1.21), ATU_LC (VT10.1)
TX_EN: ATU_MCU (D1.2), ATU_RF (VT2.1 VT4.1)
VDD_12V: ATU_MCU (8 pins), ATU_RF (8 pins), ATU_LC (33 pins)